# EasyEDA Pro project junyabadge.epro

# Schematic Schematic
Board Name: Board; Create Date: 2025-07-03; Page Name: P1; Project Name: junyabadge; Schematic Name: Schematic; Update Date: 2025-07-03; Company: EasyEDA.com; Page Size: A4; Version: V1.0
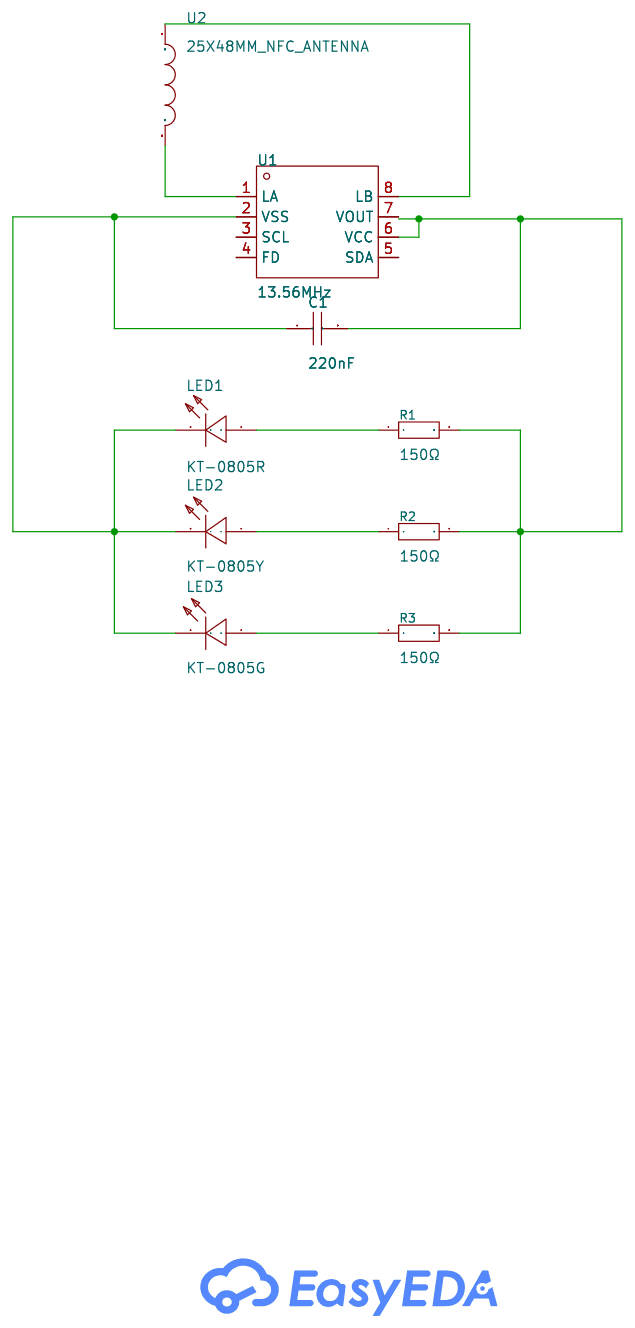
[diagram p0: schematic sheet]

## Parts
C1  220nF  [C0603]
LED1  KT-0805R  [LED0805-R-RD]
LED2  KT-0805Y  [LED0805-R-RD]
LED3  KT-0805G  [LED0805-R-RD]
R1  150Ω  [R0603]
R2  150Ω  [R0603]
R3  150Ω  [R0603]
U1  13.56MHz  [XQFN-8_L1.6-W1.6-P0.50-BL_NT3H2111W0FHKH]
U2  25X48MM_NFC_ANTENNA  [25X48MM_NFC_ANTENNA]

## Library data of the parts
C1 = CL10B224KA8NNNC: Capacitance: Tolerance:±10% Tolerance:±10% Voltage Rated: Temperature Coefficient:; LCSC Part Name: 220nF ±10% 25V; Supplier Part: C21120; Manufacturer: SAMSUNG(三星); Supplier Footprint: 0603; JLCPCB Part Class: Basic Part; Datasheet: https://atta.szlcsc.com/upload/public/pdf/source/20160218/1457707763339.pdf; Supplier: LCSC; Tolerance: ±10%
LED1 = KT-0805R: LCSC Part Name: 0805 红灯 高亮; Supplier Part: C2295; Manufacturer: KENTO; Supplier Footprint: 0805; JLCPCB Part Class: Extended Part; Supplier: LCSC
LED2 = KT-0805Y: Emitted Color:Yellow Power Dissipation:- Forward Current:- Dominant Wavelength:- Dominant Wavelength:- Peak Wavelength:- Diode Configuration:- Lens Color:- Color Temperature:- Color Temperature:- Viewing Angle:- Mounting Sytle:- Operating Temperature:- Op; LCSC Part Name: 0805 黄灯 高亮; Supplier Part: C2296; Manufacturer: KENTO; Supplier Footprint: 0805; JLCPCB Part Class: Basic Part; Datasheet: https://atta.szlcsc.com/upload/public/pdf/source/20160421/1461205044170.pdf; Supplier: LCSC; Emitted Color: Yellow
LED3 = KT-0805G: Lamp Holder Type:- Emitted Color:Emerald Forward Voltage (VF):- Forward Voltage (VF):- Power Dissipation:- Forward Current:- Dominant Wavelength:- Dominant Wavelength:- Peak Wavelength:- Diode Configuration:- Lens Color:- Color Temperature:- Color Tempera; LCSC Part Name: 0805 翠绿 高亮; Supplier Part: C2297; Manufacturer: KENTO; Supplier Footprint: 0805; JLCPCB Part Class: Basic Part; Datasheet: https://atta.szlcsc.com/upload/public/pdf/source/20170209/1486607340485.pdf; Supplier: LCSC; Emitted Color: Emerald
R1-R3 = 0603WAF1500T5E: Type:Thick Film Resistors Resistance: Tolerance:±1% Tolerance:±1% Power(Watts): Overload Voltage (Max): Temperature Coefficient:±100ppm/℃ Temperature Coefficient:±100ppm/℃ Operating Temperature Range:-55℃~+155℃ Operating Temperature Range:-55℃~+155℃; LCSC Part Name: 150Ω ±1% 100mW 厚膜电阻; Supplier Part: C22808; Manufacturer: UNI-ROYAL(厚声); Supplier Footprint: 0603; JLCPCB Part Class: Basic Part; Datasheet: https://atta.szlcsc.com/upload/public/pdf/source/20200306/C422600_1E6D84923E4A46A82E41ADD87F860B5C.pdf; Supplier: LCSC; Type: Thick Film Resistors; Tolerance: ±1%; Temperature Coefficient: ±100ppm/℃; Operating Temperature Range: -55℃~+155℃
U1 = NT3H2111W0FHKH: agreement:ISO 14443 interface type:I2C Frequency:13.56MHz Frequency:13.56MHz mains input:3.3V mains input:3.3V; Supplier Part: C710403; Manufacturer: NXP(恩智浦); Supplier Footprint: XQFN-8(1.6x1.6); JLCPCB Part Class: Extended Part; Datasheet: https://www.nxp.com/docs/en/data-sheet/NT3H2111_2211.pdf; Supplier: LCSC; agreement: ISO 14443; interface type: I2C; mains input: 3.3V
U2 = 25X48MM_NFC_ANTENNA

## Nets
$1N1284: U1.1(LA) U2.P$2
$1N1289: U1.8(LB) U2.P$1
$1N1296: LED1.1(A) R1.1
$1N1300: LED2.1(+) R2.1
$1N1305: LED3.1(A) R3.1
$1N1310: C1.1 LED1.2(K) LED2.2(-) LED3.2(K) U1.2(VSS)
$1N1317: C1.2 R1.2 R2.2 R3.2 U1.6(VCC)

Not connected (* = marked no-connect by the designer): U1 3(SCL) 4(FD) 5(SDA) 7(VOUT)

# Board PCB
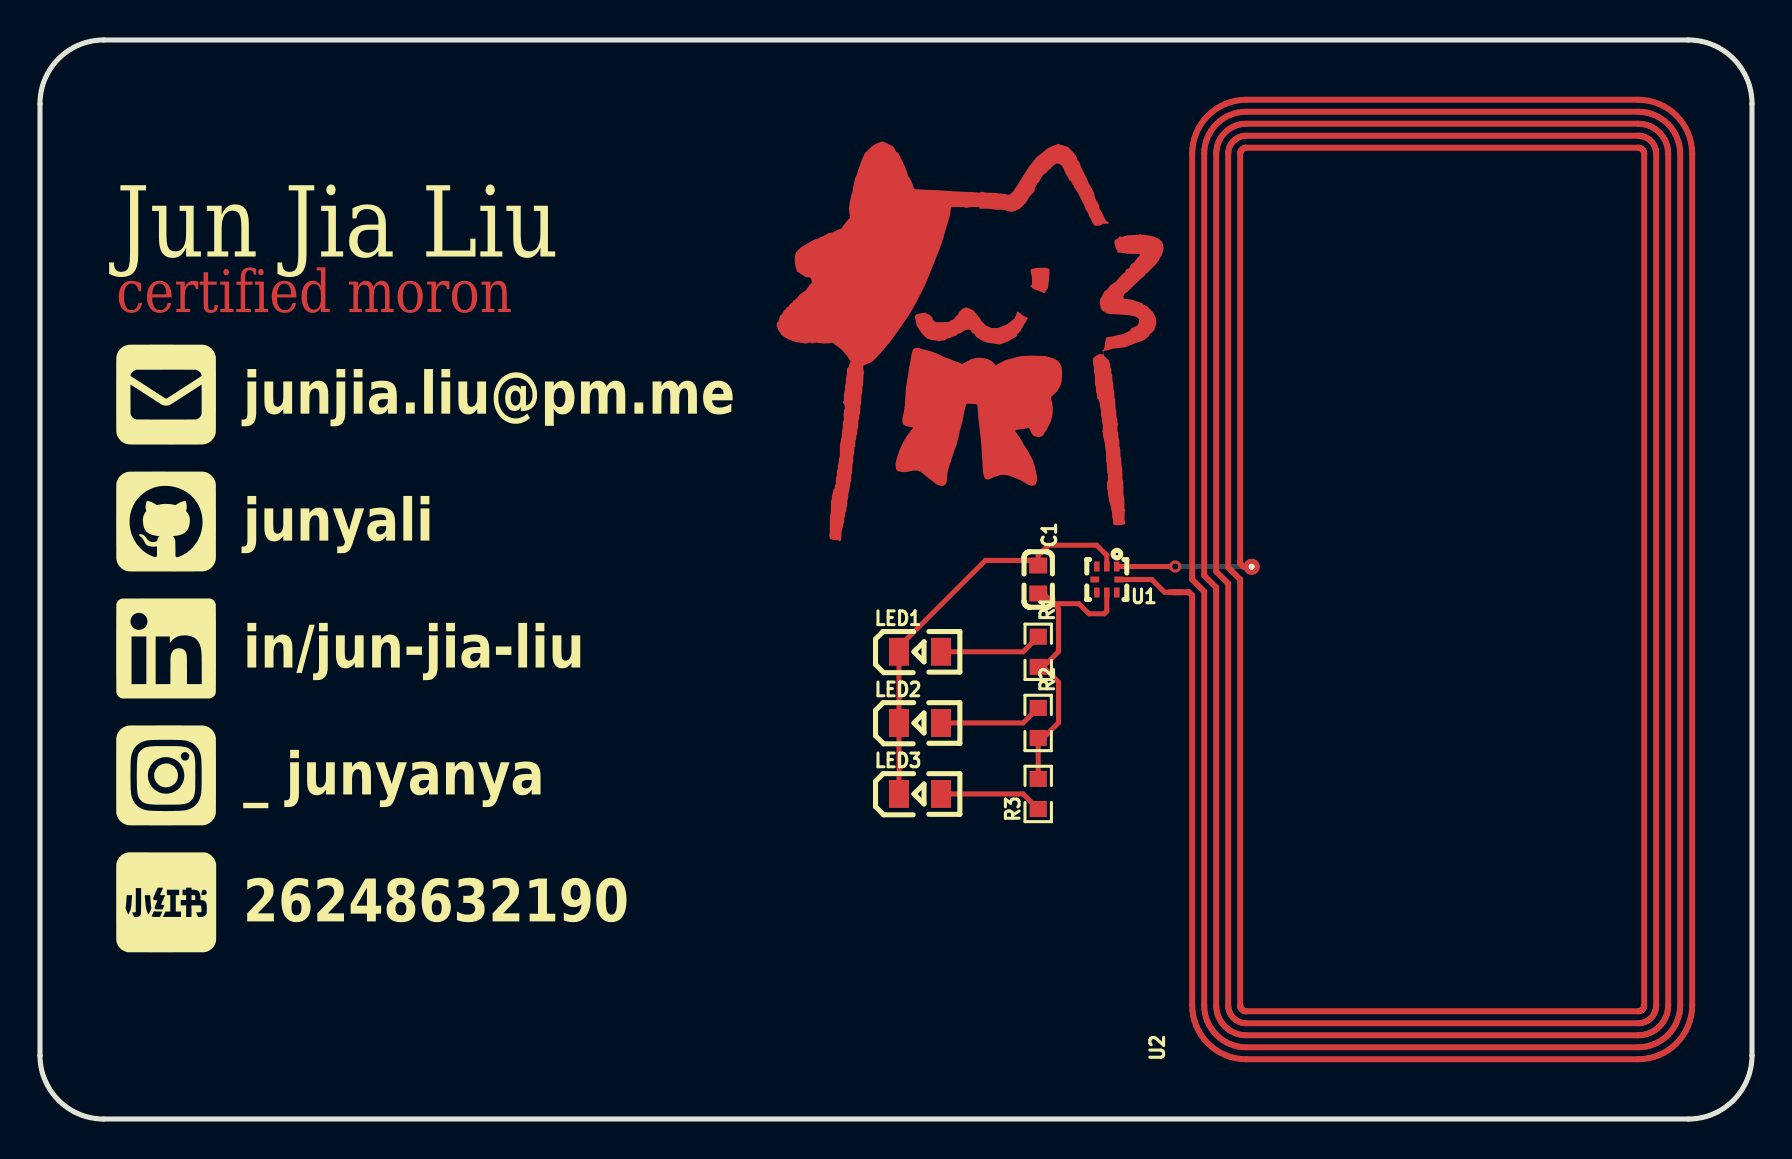
[diagram p1: board, top side]
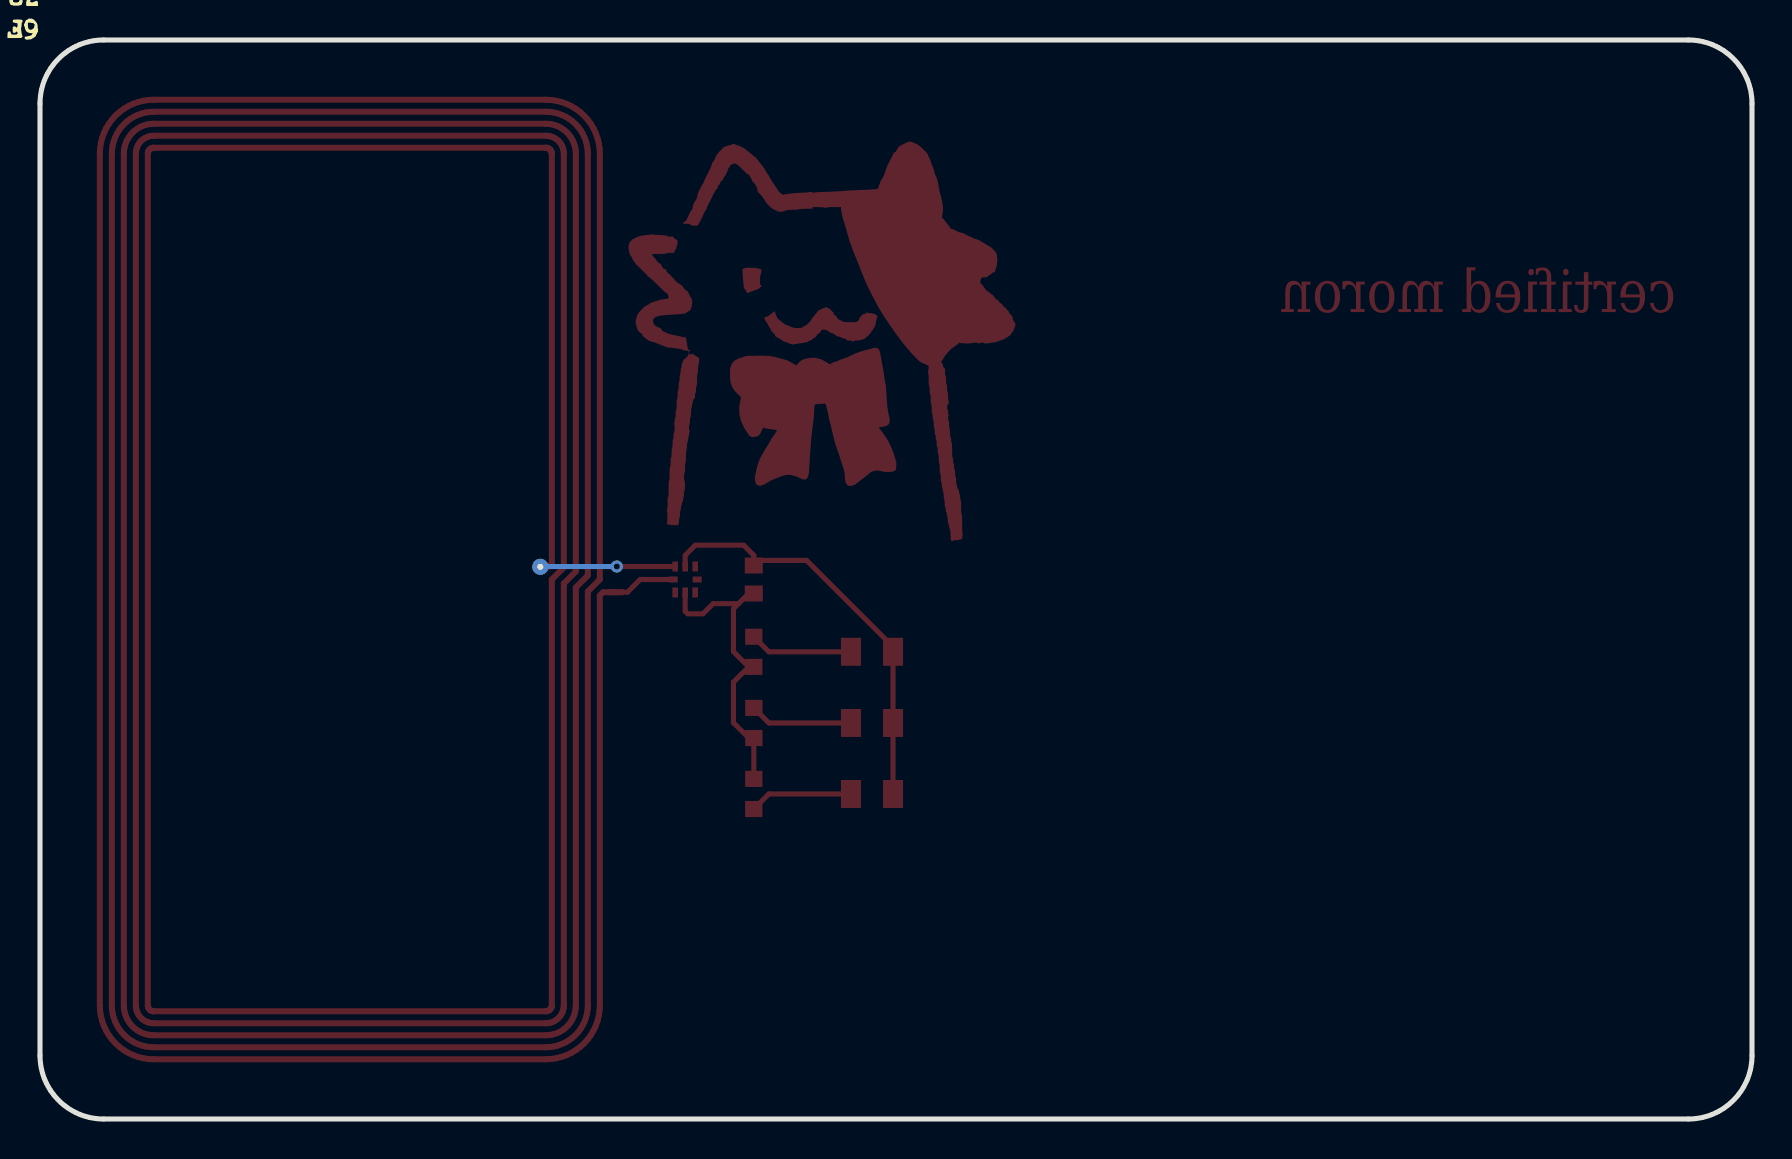
[diagram p2: board, bottom side, seen from below]

Outline 85.6 x 53.98 mm; copper layers: Top Layer, Bottom Layer. Coordinates in mm from the lower left corner of the outline.
Outline path: 0,50.8 0,3.18 arc(0.93,0.93) 3.18,0 82.42,0 arc(84.67,0.93) 85.6,3.18 85.6,50.8 arc(84.67,53.05) 82.42,53.98 3.18,53.98 arc(0.93,53.05) 0,50.8
Stack: Top Layer 0.035mm / Dielectric1 1.51mm FR4 er 4.5 / Bottom Layer 0.035mm

## Design rules (mm)
template: JLCPCB Capability(Two Layers Board)
spacing copperThickness1oz (default): track to track 0.102, other pairs 0.152 to 0.3
spacing copperThickness2oz: track to track 0.203, other pairs 0.152 to 0.3
track width copperThickness1oz (default): min 0.127, default 0.254, max 2.54
track width copperThickness2oz: min 0.203, default 0.254, max 2.54
differential pair differentialPair (default): width min 0.127, default 0.254, max 2.54; gap min 0.152, default 0.152
via viaSize (default): diameter min 0.5, default 0.61, max 10; hole min 0.3, default 0.305, max 6.3

## Placement (name value [footprint] x y rotation side)
C1  220nF  [C0603]  49.91 26.99 270 top
LED1  KT-0805R  [LED0805-R-RD]  44 23.37 0 top
LED2  KT-0805Y  [LED0805-R-RD]  44 19.81 0 top
LED3  KT-0805G  [LED0805-R-RD]  44 16.26 0 top
R1  150Ω  [R0603]  49.91 23.37 270 top
R2  150Ω  [R0603]  49.91 19.81 270 top
R3  150Ω  [R0603]  49.91 16.26 90 top
U1  13.56MHz  [XQFN-8_L1.6-W1.6-P0.50-BL_NT3H2111W0FHKH]  53.34 26.99 180 top
U2  -  [25X48MM_NFC_ANTENNA]  70.11 26.99 90 top

## Footprints (pads in the part's own frame, mm; a bottom-side part is the same pattern mirrored in y, then rotated)
25X48MM_NFC_ANTENNA
  rect 0.3x0.75 smd: P$1(-0.635,13.335)
  round 0.808 hole 0.3: P$2(0.635,9.525)
C0603
  rect 0.8x0.9 smd: 1(-0.7,0) 2(0.7,0)
LED0805-R-RD
  rect 1x1.399 smd: 1(1.05,0) 2(-1.05,0)
R0603
  rect 0.806x0.864 smd: 1(-0.753,0) 2(0.753,0)
XQFN-8_L1.6-W1.6-P0.50-BL_NT3H2111W0FHKH
  rect 0.28x0.5 smd: 1(-0.5,-0.65) 2(0,-0.65) 3(0.5,-0.65) 5(0.5,0.65) 6(0,0.65) 7(-0.5,0.65)
  rect 0.45x0.3 smd: 4(0.6,0) 8(-0.6,0)

## Nets
As in the schematic.

Pads without a net: U1 3 4 5 7

## Via types
v1: diameter 0.61, hole 0.305, Top Layer to Bottom Layer, 1 via

## Routing (per net, layer and track width the routed paths; a pad name or vN(x,y) marks a point on that pad's centre or on a via; arc(x,y) is an arc through that point)
$1N1284: length 6.8
  Top Layer w0.254: U1.1 v1(56.76,27.64)
  Bottom Layer w0.254: 60.58,27.62 60.57,27.64 v1(56.76,27.64)
$1N1289: length 3.1
  Top Layer w0.254: U2.P$1 56.23,26.35 55.59,26.99 U1.8
$1N1296: length 5.2
  Top Layer w0.254: LED1.1 49.16,23.37 R1.1
$1N1300: length 5.2
  Top Layer w0.254: LED2.1 49.16,19.81 R2.1
$1N1305: length 5.2
  Top Layer w0.254: LED3.1 49.16,16.26 R3.1
$1N1310: length 21.1
  Top Layer w0.254: LED3.2 LED2.2 LED1.2 42.95,23.63 47.27,27.94 49.66,27.94 C1.1 49.91,28.2 50.42,28.71 52.83,28.71 53.34,28.2 U1.2
$1N1317: length 15.2
  Top Layer w0.254: 50.16,22.62 50.93,23.38 50.93,25.53 50.67,25.78 ; 50.16,22.62 50.93,21.86 50.93,19.82 50.16,19.06 R2.2 49.91,17.02 ; 50.16,22.62 R1.2 ; 50.67,25.78 50.16,26.29 C1.2 ; 50.67,25.78 51.94,25.78 52.45,25.27 53.21,25.27 53.34,25.4 U1.6

Small or netless copper shapes (teardrops, artwork), in the pictures only: 5 on Top Layer

## Text on the board
Top Layer: certified moron
Top Solder Mask Layer: certified moron
Top Silkscreen Layer: junjia.liu@pm.me | junyali | in/jun-jia-liu | _ junyanya | 26248632190 | Jun Jia Liu
